# Altium project mmWave_PCB.PrjPcb (part 2 of 2)

## Sheet AOPIO.SchDoc
size B; SheetNumber: 4; SheetTotal: 5
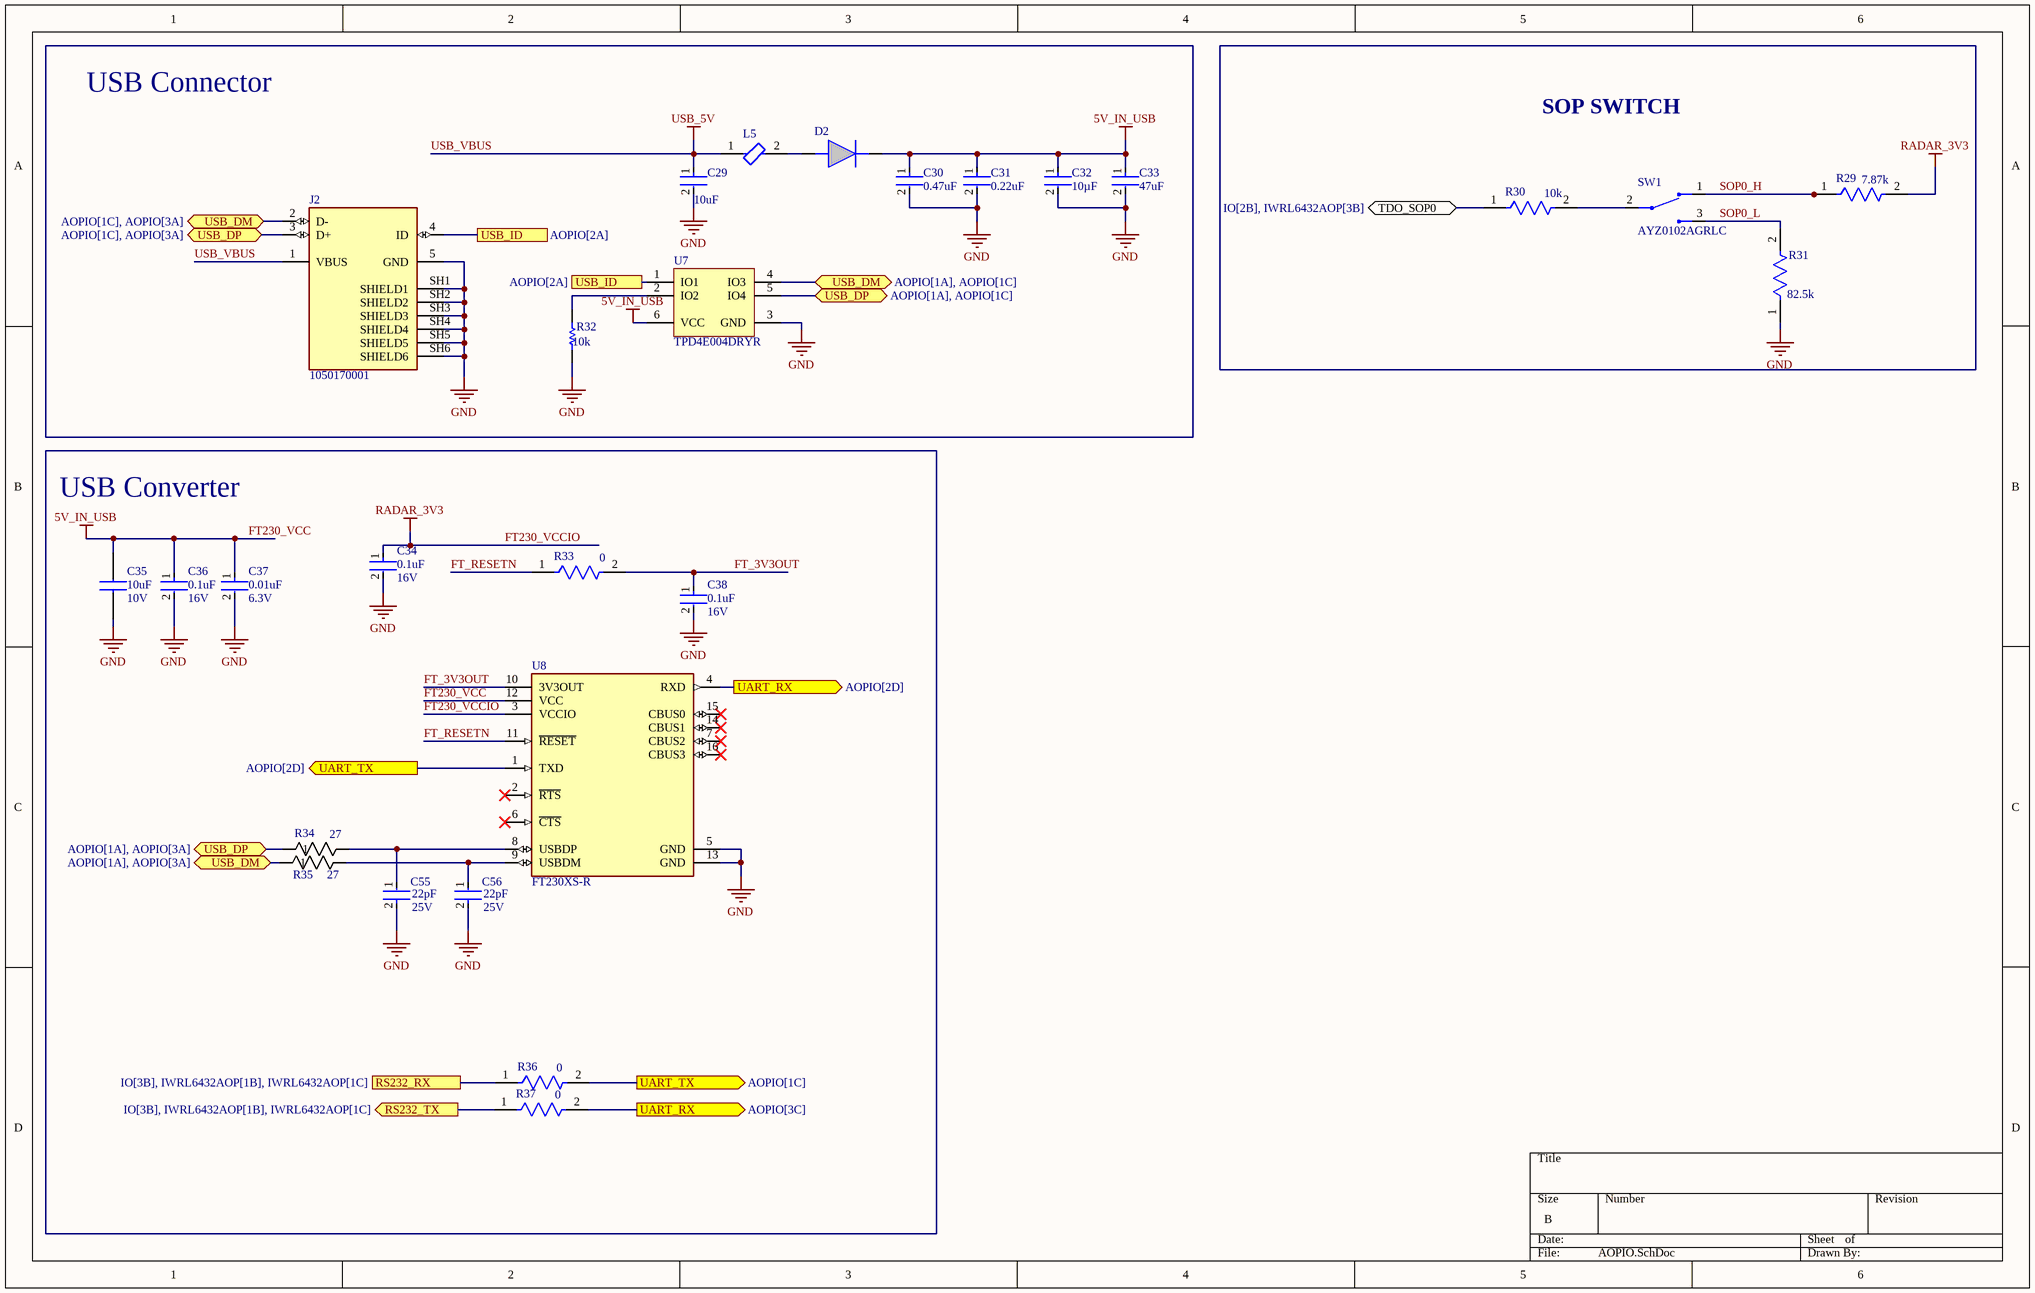
[diagram p3: AOPIO.SchDoc]

### Parts
C29  Capacitance: 10uF  [FP-GRT188-0_15-IPC_C]  (hidden comment: GRT188R61A106KE13D)
C30  Capacitance: 0.47uF  [FP-GCM155-0_1-IPC_B]  (hidden comment: GCM155C71A474ME36J)
C31  Capacitance: 0.22uF  [FP-GCM155-0_05-MFG]  (hidden comment: GCM155R71C224KE02D)
C32  Capacitance: 10µF  [FP-GRM155-0_2-MFG]  (hidden comment: GRM155R61A106ME18D)
C33  Capacitance: 47uF  [FP-GRM31C-0_2-e0_3_0_8-IPC_C]  (hidden comment: GRM31CR61A476ME15L)
C34  Capacitance: 0.1uF  Voltage Rating (DC): 16V  [FP-GRM033-0_03-IPC_C]  (hidden comment: GRM033R61C104ME14D)
C35  Capacitance: 10uF  Voltage: 10V  [CAPC1005X56N]  (hidden comment: 0402ZD106MAT2A)
C36  Capacitance: 0.1uF  Voltage Rating (DC): 16V  [FP-GRM033-0_03-IPC_C]  (hidden comment: GRM033R61C104ME14D)
C37  Voltage Rating (DC): 6.3V  Capacitance: 0.01uF  [FP-GRM033-0_03-IPC_A]  (hidden comment: GRM033R70J103KA01D)
C38  Capacitance: 0.1uF  Voltage Rating (DC): 16V  [FP-GRM033-0_03-IPC_C]  (hidden comment: GRM033R61C104ME14D)
C55  Voltage: 25V  Capacitance: 22pF  [FP-GCM033-0_03-IPC_B]  (hidden comment: GCM0335C1E220JA16D)
C56  Voltage: 25V  Capacitance: 22pF  [FP-GCM033-0_03-IPC_B]  (hidden comment: GCM0335C1E220JA16D)
D2  PMEG3020EP_115  [SODFL4725X110N]  (value not drawn)
J2  1050170001  [MOLEX_1050170001]
L5  BLM15PD300SZ1D  [FP-BLM15-0_05-d0_7-IPC_A]  (value not drawn)
R29  Resistance: 7.87k  [FP-CRCW0402-e3-MFG]  (hidden comment: CRCW04027K87FKED)
R30  Resistance: 10k  [FP-CRCW0402-C-e3-IPC_C]  (hidden comment: CRCW040210K0FKEDC)
R31  Resistance: 82.5k  [FP-CRCW0402-e3-MFG]  (hidden comment: CRCW040282K5FKED)
R32  Resistance: 10k  [RESC1005X40X25ML05T10]  (hidden comment: CRCW040210K0FKEDHP)
R33  Resistance: 0  [FP-RC0402-0_4-MFG]  (hidden comment: RC0402JR-070RP)
R34  Resistance: 27  [RES_RC0201_P6XP3_YAG]  (hidden comment: RC0201JR-0727RL)
R35  Resistance: 27  [RES_RC0201_P6XP3_YAG]  (hidden comment: RC0201JR-0727RL)
R36  Resistance: 0  [FP-RC0402-0_4-MFG]  (hidden comment: RC0402JR-070RP)
R37  Resistance: 0  [FP-RC0402-0_4-MFG]  (hidden comment: RC0402JR-070RP)
SW1  AYZ0102AGRLC  [SW_AYZ0102AGRLC]
U7  TPD4E004DRYR  [DRY0006A]
U8  FT230XS-R  [FP-SSOP-16-MFG]

### Ports
RS232_RX (see IO[3B], IWRL6432AOP[1B], IWRL6432AOP[1C]), RS232_TX (out, see IO[3B], IWRL6432AOP[1B], IWRL6432AOP[1C]), TDO_SOP0 (bidir, see IO[2B], IWRL6432AOP[3B]), UART_RX (out, see AOPIO[2D]), UART_RX (out, see AOPIO[3C]), UART_TX (out, see AOPIO[1C]), UART_TX (out, see AOPIO[2D]), USB_DM (bidir, see AOPIO[1A], AOPIO[1C]), USB_DM (bidir, see AOPIO[1A], AOPIO[3A]), USB_DM (bidir, see AOPIO[1C], AOPIO[3A]), USB_DP (bidir, see AOPIO[1A], AOPIO[1C]), USB_DP (bidir, see AOPIO[1A], AOPIO[3A]), USB_DP (bidir, see AOPIO[1C], AOPIO[3A]), USB_ID (see AOPIO[2A])

### Nets
FT230_VCC: C30.1 C31.1 C32.1 C33.1 C35.2 C36.1 C37.1 D2.1(K) U7.6(VCC) U8.12(VCC)  [also labelled 5V_IN_USB]
FT230_VCCIO: C34.1 R29.2 U8.3(VCCIO)  [also labelled RADAR_3V3]
GND: C29.2 C30.2 C31.2 C32.2 C33.2 C34.2 C35.1 C36.2 C37.2 C38.2 C55.2 C56.2 J2.5(GND) J2.SH1(SHIELD1) J2.SH2(SHIELD2) J2.SH3(SHIELD3) J2.SH4(SHIELD4) J2.SH5(SHIELD5) J2.SH6(SHIELD6) R31.1 R32.1 U7.3(GND) U8.5(GND) U8.13(GND)
USB_VBUS: C29.1 J2.1(VBUS) L5.1  [also labelled USB_5V]
FT_3V3OUT: C38.1 R33.2 U8.10(3V3OUT)
FT_RESETN: R33.1 U8.11(~{RESET})
SOP0_H: R29.1 SW1.1
SOP0_L: R31.2 SW1.3
NetC55_1: C55.1 R34.2 U8.8(USBDP)
NetC56_1: C56.1 R35.2 U8.9(USBDM)
NetD2_2: D2.2(A) L5.2
NetJ1_7: R30.1 ; port TDO_SOP0
NetJ1_8: R37.1 ; port RS232_TX
NetJ1_10: R36.1 ; port RS232_RX
NetJ2_2: J2.2(D-) R35.1 U7.4(IO3) ; port USB_DM
NetJ2_3: J2.3(D+) R34.1 U7.5(IO4) ; port USB_DP
NetJ2_4: J2.4(ID) U7.1(IO1) ; port USB_ID
NetR30_2: R30.2 SW1.2
NetR32_2: R32.2 U7.2(IO2)
NetR36_2: R36.2 U8.1(TXD) ; port UART_TX
NetR37_2: R37.2 U8.4(RXD) ; port UART_RX

Not connected (* = marked no-connect by the designer): U8 2(~{RTS})* 6(~{CTS})* 7(CBUS2)* 14(CBUS1)* 15(CBUS0)* 16(CBUS3)*

### Notes on the sheet
- USB Connector
- SOP SWITCH
- USB Converter

### Library data of the parts
C29 = CMP-06035-045859-1: Multi-Layer Ceramic Capacitor 10uF 10V X5R ±10% 0603 Paper T/R; Ratings: AEC-Q200; Case Code (Imperial): 0603; Width: 0.031inch; Length: 0.063inch; Case Code (Metric): 1608; Case/Package: 0603; Packaging: Cut Tape; Thickness: 0.035inch; Max Operating Temperature: 85°C; Voltage Rating: 10V; Mount: Surface Mount; Min Operating Temperature: -55°C; Tolerance: 10%
C30 = CMP-06035-037205-1: Ceramic Capacitor for Automotive 470nF ±20% 10VDC X7S 0402 Paper T/R
C31 = CMP-06035-016531-1: Ceramic Capacitor for Automotive 220nF ±10% 16VDC X7R 0402 Paper T/R; Voltage Rating (DC): 16V; Thickness: 0.022inch; Length: 0.039inch; Dielectric: X7R; Packaging: Tape and Reel; Min Operating Temperature: -55°C; Case Code (Imperial): 0402; Tolerance: 10%; Lead Free: Lead Free; Max Operating Temperature: 125°C; Case/Package: 0402; Mount: Surface Mount; Case Code (Metric): 1005; Weight: 0.000212oz; Height: 0.5mm; Voltage Rating: 16V; Ratings: AEC-Q200; Package Quantity: 10000; Termination: SMD/SMT; Width: 0.5mm
C32 = CMP-00260-135863763-1: Tolerance: 20%; Dielectric: X5R; Voltage Rating (DC): 10V; Material: Ceramic; Thickness: 500µm; Height: 700µm; Lifecycle Status: Production; Min Operating Temperature: -55°C; Voltage Rating: 10V; Case/Package: 0402; Max Operating Temperature: 85°C; NexarPartId: 135863763; Length: 1mm; Width: 500µm
C33 = CMP-2000-05255-3: Chip Multilayer Ceramic Capacitors for General Purpose, 1206, 47uF, X5R, 15%, 20%, 10V; Case/Package: 1206; Radiation Hardening: No; Case Code (Metric): 3216; Max Operating Temperature: 85°C; Tolerance: 20%; REACH SVHC: No SVHC; Depth: 1.6mm; Case Code (Imperial): 1206; Termination: SMD/SMT; Voltage Rating (DC): 10V; Package Quantity: 2000; Voltage Rating: 10V; Width: 1.6mm; Lead Free: Lead Free; Voltage: 10V; Packaging: Tape and Reel; Length: 3.2mm; Height: 1.6mm; Number of Pins: 2; Thickness: 0.071inch; Min Operating Temperature: -55°C; Dielectric: X5R; Mount: Surface Mount
C34 C36 C38 = CMP-06035-002210-1: Chip Multilayer Ceramic Capacitors for General Purpose, 0201, 0.10uF, X5R, 15%, 20%, 16V; Thickness: 300um; Dielectric: X5R; Width: 300um; Length: 600um; Tolerance: 20%
C35 = 0402ZD106MAT2A: Multilayer Ceramic Capacitors MLCC - SMD/SMT 10V 10uF X5R 0402 20% Tol; Manufacturer_Name: Kyocera AVX; Geometry.Height: 0.56mm; Manufacturer_Part_Number: 0402ZD106MAT2A; Mouser Part Number: 581-0402ZD106MAT2A; Mouser Price/Stock: https://www.mouser.co.uk/ProductDetail/KYOCERA-AVX/0402ZD106MAT2A?qs=sJ5gq5MLFXpDfmjiItAxIg%3D%3D; Arrow Part Number: 0402ZD106MAT2A; Arrow Price/Stock: https://www.arrow.com/en/products/0402zd106mat2a/avx?utm_currency=USD&region=nac; Datasheet Link: http://www.mouser.com/catalog/supplier/library/pdf/AVXSurfaceMountCeramic.pdf
C37 = CMP-1033-00635-3: Chip Multilayer Ceramic Capacitors for General Purpose, 0201, 10000pF, X7R, 15%, 10%, 6.3V; Lead Free: Lead Free; Max Operating Temperature: 125°C; Height: 0.3mm; REACH SVHC: No SVHC; Voltage Rating: 6.3V; Width: 0.012inch; Tolerance: 10%; Min Operating Temperature: -55°C; Length: 0.6mm; Thickness: 0.013inch; Depth: 0.3mm; Case/Package: 0201; Case Code (Imperial): 0201; Packaging: Tape and Reel; Voltage: 6.3V; Package Quantity: 15000; Mount: Surface Mount; Case Code (Metric): 0603; Dielectric: X7R; Radiation Hardening: No; Termination: SMD/SMT
C55 C56 = CMP-06035-052402-1: Ceramic Capacitor for Automotive 22pF  ±5% 25VDC C0G 0201 Paper T/R
D2 = PMEG3020EP_115: Schottky Diodes & Rectifiers SCHOTTKY RECT 30V 2A; Manufacturer_Name: Nexperia; Manufacturer_Part_Number: PMEG3020EP,115; Geometry.Height: 1.1mm; Mouser Part Number: 771-PMEG3020EP115; Mouser Price/Stock: https://www.mouser.co.uk/ProductDetail/Nexperia/PMEG3020EP115?qs=GcY6OjH1zdnlY%252B06tUqEyw%3D%3D; Arrow Part Number: PMEG3020EP,115; Arrow Price/Stock: https://www.arrow.com/en/products/pmeg3020ep115/nexperia?region=nac; Datasheet Link: https://assets.nexperia.com/documents/data-sheet/PMEG3020EP.pdf
J2 = 1050170001: USB - micro B USB 2.0 Receptacle Connector 5 Position Surface Mount, Right Angle; Through Hole; MF: Molex; SnapEDA_Link: https://www.snapeda.com/parts/1050170001/Molex/view-part/?ref=snap; Package: None; Value: *; MP: 1050170001; Check_prices: https://www.snapeda.com/parts/1050170001/Molex/view-part/?ref=eda
L5 = CMP-06046-002100-1: Chip Ferrite Bead, 0402, 30Ω @ 100MHz, 0.035Ω, 25%, 2.2A; Number of Lines: 1; DC Resistance (DCR): 35mR; Packaging: Tape and Reel; Max Current Rating: 2.2A; Mount: Surface Mount; Min Operating Temperature: -55°C; Case Code (Metric): 1005; Case Code (Imperial): 0402; RoHS Compliant: Yes; Ratings: AEC-Q200; Max Operating Temperature: 125°C; Case/Package: 0402
R29 = CMP-2002-00224-2: RES Thick Film, 7.87kΩ, 1%, 0.063W, 100ppm/°C, 0402; Max Power Dissipation: 63mW; Voltage Rating: 50V; Tolerance: 1%; Weight: 2.3E-05oz; Series: CRCW; Technology: THICK FILM; Case Code (Metric): 1005; Min Operating Temperature: -55°C; Power Rating: 63mW; Packaging: Tape and Reel; RoHS Compliant: Yes; Radiation Hardening: No; Max Operating Temperature: 155°C; Depth: 0.5mm; Contact Plating: Tin; Resistor Type: Thick Film; Width: 0.5mm; Features: Automotive AEC-Q200; Height: 0.35mm; Case Code (Imperial): 0402; Number of Pins: 2; Lead Free: Lead Free; Military Standard: Not; Size Code: 0402; Voltage Rating (DC): 50V; Package Quantity: 10; Mount: Surface Mount; Number of Terminations: 2; Termination: SMD/SMT; Construction: Rectangular; Length: 1mm; Case/Package: 0402; Temperature Coefficient: 100ppm/°C; Resistance Tolerance: 1%
R30 = CMP-02407-012085-1: RES 10K OHM 1% 1/16W 0402; Temperature Coefficient: 100ppm/°C; Power Rating: 62.5mW; Lead Free: Lead Free; Max Operating Temperature: 155°C; RoHS Compliant: Yes; Mount: Surface Mount; Min Operating Temperature: -55°C; Termination: Wraparound; Length: 1mm; Resistor Type: Thick Film; Contact Plating: Tin; Tolerance: 1%; Case/Package: Molded
R31 = CMP-2002-00237-2: RES Thick Film, 82.5kΩ, 1%, 0.063W, 100ppm/°C, 0402; Max Power Dissipation: 63mW; Voltage Rating (DC): 50V; Temperature Coefficient: 100ppm/°C; Number of Terminations: 2; Termination: SMD/SMT; Lead Free: Lead Free; Weight: 2.3E-05oz; Length: 1mm; Max Operating Temperature: 155°C; Features: Automotive AEC-Q200; Composition: Thick Film; Case Code (Metric): 1005; Packaging: Tape and Reel; Radiation Hardening: No; Power Rating: 63mW; Military Standard: Not; Case Code (Imperial): 0402; Width: 0.5mm; Height: 0.35mm; Voltage Rating: 50V; Depth: 0.5mm; Package Quantity: 10; Case/Package: 0402; Min Operating Temperature: -55°C; Tolerance: 1%; Contact Plating: Tin
R32 = CMP-2002-03043-1: Manufacturer: Vishay Dale; Part Number: CRCW040210K0FKEDHP
R33 R36 R37 = CMP-03412-037830-1: RES SMD 0 OHM JUMPER 1/16W 0402; Max Power Dissipation: 63mW; Width: 0.02inch; Height: 0.016inch; Length: 0.039inch; Number of Terminations: 2; Max Operating Temperature: 155°C; Case Code (Metric): 1005; Resistor Type: Thick Film; RoHS Compliant: Yes; Packaging: Tape and Reel; Min Operating Temperature: -55°C; Case/Package: 0402; Features: Moisture Resistant; Case Code (Imperial): 0402
R34 R35 = RC0201JR-0727RL: No Description Available; Manufacturer_Name: Yageo; Copyright: Copyright (C) 2026 Ultra Librarian. All rights reserved.; Manufacturer_Part_Number: RC0201JR-0727RL
SW1 = AYZ0102AGRLC: Slide Switch SPDT Surface Mount, Right Angle; MF: C&K; Digi-Key_Part_Number: 401-2012-1-ND; Package: None; MP: AYZ0102AGRLC; SnapEDA_Link: https://www.snapeda.com/parts/AYZ0102AGRLC/C%26K/view-part/50616/?ref=snap; Digi-Key_Purchase_URL: https://www.digikey.com/product-detail/en/c-k/AYZ0102AGRLC/401-2012-1-ND/1640121?utm_source=snapeda&utm_medium=aggregator&utm_campaign=symbol; Value: *
U7 = CMP-0326-00024-3: ESD-Protection Array for High-Speed Data Interfaces, 4 Channels, -40 to +85 degC, 6-pin SON (DRY), Green (RoHS & no Sb/Br); Manufacturer: Texas Instruments; USB High Speed: TRUE; IO Capacitance(Typ)(pF): 1.6; IEC 61000-4-2 Air-Gap(+/- kV): 12; SubFamily: ESD Solution; IO Leakage Current(nA): 1; Breakdown Voltage(Min)(V): 6; IEC 61000-4-2 Contact(+/- kV): 8; ComponentLink3Description: URL Link1; ComponentLink3URL: SamplesURL:http://www.ti.com/product/tpd4e004#samples; PackageReference: DRY0006A; ComponentLink2URL: http://www.ti.com/general/docs/lit/getliterature.tsp?genericPartNumber=TPD4E004&fileType=pdf; ComponentLink2Description: Datasheet; DatasheetVersion: SLVS729A; ComponentLink1Description: Manufacturer URL; PackageDescription: 6-Pin Plastic Small Outline No-Lead, 1 x 1.45 x 0.6 mm Body, 0.5 mm Pitch; 1394 / Firewire: TRUE; Serial ATA / eSATA: TRUE; Eco-Plan: Green (RoHS & no Sb/Br); ComponentLink1URL: http://www.ti.com/; PackageVersion: revF, Dec-2011; Mounting Technology: Surface Mount; PartNumber: TPD4E004DRYR
U8 = CMP-0248-00026-3: IC USB SERIAL BASIC UART 16SSOP; Min Supply Voltage: 2.97V; Data Rate: 12Mbps; Operating Supply Voltage: 5V; Number of Channels: 1; Max Supply Voltage: 5.5V; Operating Supply Current: 8mA; Case/Package: SSOP; Length: 5mm; Interface: UART; Mount: Surface Mount; Number of Pins: 16; Packaging: Tape and Reel; Weight: 0.004586oz; Min Operating Temperature: -40°C; Width: 0.157inch; Height: 0.059inch; Package Quantity: 3000; Max Operating Temperature: 85°C

## Sheet IO.SchDoc
size A; SheetNumber: 5; SheetTotal: 5
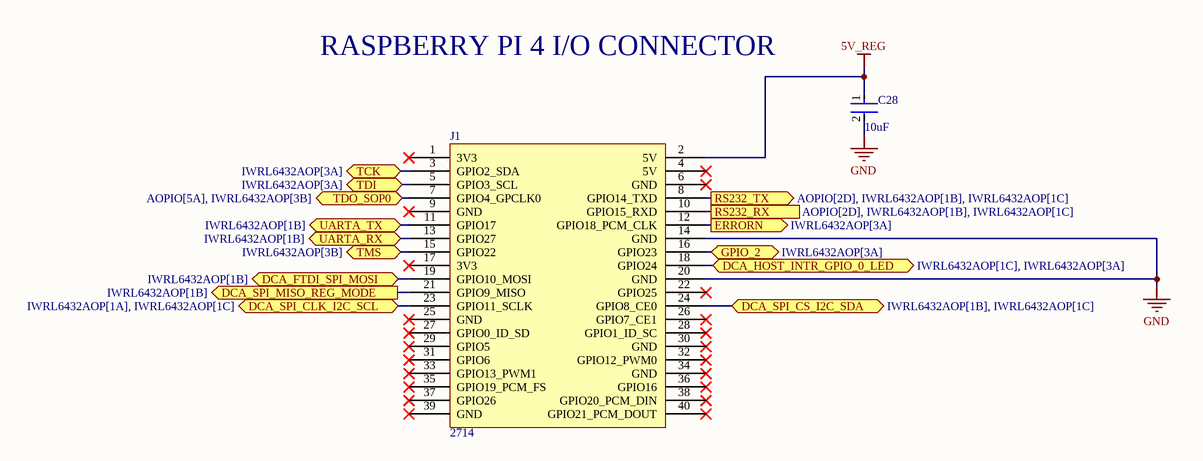
[diagram p4: IO.SchDoc]

### Parts
C28  Capacitance: 10uF  [FP-GRM188-0_2-MFG]  (hidden comment: GRM188C81A106MA73D)
J1  2714  [2714]

### Ports
DCA_FTDI_SPI_MOSI (bidir, see IWRL6432AOP[1B]), DCA_HOST_INTR_GPIO_0_LED (bidir, see IWRL6432AOP[1C], IWRL6432AOP[3A]), DCA_SPI_CLK_I2C_SCL (bidir, see IWRL6432AOP[1A], IWRL6432AOP[1C]), DCA_SPI_CS_I2C_SDA (bidir, see IWRL6432AOP[1B], IWRL6432AOP[1C]), DCA_SPI_MISO_REG_MODE (out, see IWRL6432AOP[1B]), ERRORN (out, see IWRL6432AOP[3A]), GPIO_2 (bidir, see IWRL6432AOP[3A]), RS232_RX (see AOPIO[2D], IWRL6432AOP[1B], IWRL6432AOP[1C]), RS232_TX (out, see AOPIO[2D], IWRL6432AOP[1B], IWRL6432AOP[1C]), TCK (bidir, see IWRL6432AOP[3A]), TDI (bidir, see IWRL6432AOP[3A]), TDO_SOP0 (bidir, see AOPIO[5A], IWRL6432AOP[3B]), TMS (bidir, see IWRL6432AOP[3B]), UARTA_RX (bidir, see IWRL6432AOP[1B]), UARTA_TX (bidir, see IWRL6432AOP[1B])

### Nets
5V_REG: C28.1 J1.2(5V)
GND: C28.2 J1.14(GND) J1.20(GND)
NetJ1_3: J1.3(GPIO2_SDA) ; port TCK
NetJ1_5: J1.5(GPIO3_SCL) ; port TDI
NetJ1_7: J1.7(GPIO4_GPCLK0) ; port TDO_SOP0
NetJ1_8: J1.8(GPIO14_TXD) ; port RS232_TX
NetJ1_10: J1.10(GPIO15_RXD) ; port RS232_RX
NetJ1_11: J1.11(GPIO17) ; port UARTA_TX
NetJ1_12: J1.12(GPIO18_PCM_CLK) ; port ERRORN
NetJ1_13: J1.13(GPIO27) ; port UARTA_RX
NetJ1_15: J1.15(GPIO22) ; port TMS
NetJ1_16: J1.16(GPIO23) ; port GPIO_2
NetJ1_18: J1.18(GPIO24) ; port DCA_HOST_INTR_GPIO_0_LED
NetJ1_19: J1.19(GPIO10_MOSI) ; port DCA_FTDI_SPI_MOSI
NetJ1_21: J1.21(GPIO9_MISO) ; port DCA_SPI_MISO_REG_MODE
NetJ1_23: J1.23(GPIO11_SCLK) ; port DCA_SPI_CLK_I2C_SCL
NetJ1_24: J1.24(GPIO8_CE0) ; port DCA_SPI_CS_I2C_SDA

Not connected (* = marked no-connect by the designer): J1 1(3V3)* 4(5V)* 6(GND)* 9(GND)* 17(3V3)* 22(GPIO25)* 25(GND)* 26(GPIO7_CE1)* 27(GPIO0_ID_SD)* 28(GPIO1_ID_SC)* 29(GPIO5)* 30(GND)* 31(GPIO6)* 32(GPIO12_PWM0)* 33(GPIO13_PWM1)* 34(GND)* 35(GPIO19_PCM_FS)* 36(GPIO16)* 37(GPIO26)* 38(GPIO20_PCM_DIN)* 39(GND)* 40(GPIO21_PCM_DOUT)*

### Notes on the sheet
- RASPBERRY PI 4 I/O CONNECTOR

### Library data of the parts
C28 = CMP-06035-002932-1: Chip Multilayer Ceramic Capacitors for General Purpose, 0603, 10uF, X6S, 22%, 20%, 10V; Case Code (Metric): 1608; Max Operating Temperature: 105°C; Voltage Rating (DC): 10V; Thickness: 0.031inch; Width: 0.031inch; Dielectric: X6S; Lead Free: Lead Free; REACH SVHC: No SVHC; Case/Package: 0603; Length: 0.063inch; Min Operating Temperature: -55°C; Package Quantity: 4000; Voltage Rating: 10V; Tolerance: 20%; Packaging: Cut Tape; Material: Ceramic; Mount: Surface Mount; Case Code (Imperial): 0603; Height: 0.8mm
J1 = 2714: Extra-Tall Smt Gpio Header For Raspberry Pi Hat - 2X20 Extra Tall Female Header |Adafruit 2714; Manufacturer: Adafruit Industries; Supplier: Arrow Electronics; Supplier Part Number: 2714; Manufacturer Part Number: 2714; Category: Headers and Wire Housings; Stock: 1; Pricing: 1=2.95 (USD); RoHS: Non-Compliant; Schedule B: 8536694040, 8536694040|8536694040|8536694040|8536694040|8536694040

## Nets that join several sheets
5V_REG: DC_Regulator (5 pins), IO (C28.1 J1.2)
FT230_VCC: DC_Regulator (C26.1 C27.1 U2.6), AOPIO (10 pins)
FT230_VCCIO: IWRL6432AOP (8 pins), DC_Regulator (C41.1 U4.1), AOP_Decoupling (8 pins), AOPIO (C34.1 R29.2 U8.3)
GND: IWRL6432AOP (41 pins), DC_Regulator (30 pins), AOP_Decoupling (19 pins), AOPIO (24 pins), IO (C28.2 J1.14 J1.20)
RADAR_1P2_RF: IWRL6432AOP (U1.L7 U1.L8 U1.L9 U1.L10), AOP_Decoupling (C18.1 C19.1)
RADAR_1V2: IWRL6432AOP (R27.1 U1.K2), AOP_Decoupling (C17.1)
RADAR_1V4_APLL: IWRL6432AOP (U1.G8), AOP_Decoupling (C6.1)
RADAR_1V4_SYNTH: IWRL6432AOP (U1.F7), AOP_Decoupling (C7.1)
RADAR_1V8: IWRL6432AOP (16 pins), AOP_Decoupling (C2.1 C3.1 C4.1)
RADAR_1V_RF_OUT: IWRL6432AOP (5 pins), AOP_Decoupling (C13.1 C14.1)
RADAR_SRAM_1V2: IWRL6432AOP (U1.M1 U1.M2 U1.N2), AOP_Decoupling (C11.1 C12.1)
RADAR_VBGAP: IWRL6432AOP (U1.H10), AOP_Decoupling (C5.1)
NetJ1_3: IWRL6432AOP (U1.F3), IO (J1.3)
NetJ1_5: IWRL6432AOP (U1.F2), IO (J1.5)
NetJ1_7: IWRL6432AOP (R1.2), AOPIO (R30.1), IO (J1.7)
NetJ1_8: IWRL6432AOP (R3.2 U1.H4), AOPIO (R37.1), IO (J1.8)
NetJ1_10: IWRL6432AOP (R4.2 U1.G2), AOPIO (R36.1), IO (J1.10)
NetJ1_11: IWRL6432AOP (U1.K3), IO (J1.11)
NetJ1_12: IWRL6432AOP (U1.J4), IO (J1.12)
NetJ1_13: IWRL6432AOP (U1.J3), IO (J1.13)
NetJ1_15: IWRL6432AOP (U1.G3), IO (J1.15)
NetJ1_16: IWRL6432AOP (U1.H2), IO (J1.16)
NetJ1_18: IWRL6432AOP (R16.2 U1.J2), IO (J1.18)
NetJ1_19: IWRL6432AOP (U1.E3), IO (J1.19)
NetJ1_21: IWRL6432AOP (U1.E4), IO (J1.21)
NetJ1_23: IWRL6432AOP (R5.2 U1.F1), IO (J1.23)
NetJ1_24: IWRL6432AOP (R6.2 U1.F4), IO (J1.24)
NetR7_1: IWRL6432AOP (U1.D3), AOP_Decoupling (R7.1 U3.1)
NetR8_1: IWRL6432AOP (U1.B3 U1.B4), AOP_Decoupling (R8.1 R14.1)
NetR9_1: IWRL6432AOP (U1.C4), AOP_Decoupling (R9.1 R13.1)
NetR10_1: IWRL6432AOP (U1.D2), AOP_Decoupling (R10.1)
NetR11_1: IWRL6432AOP (U1.C2), AOP_Decoupling (R11.1)
NetR12_1: IWRL6432AOP (U1.C3), AOP_Decoupling (R12.1)